# EAGLE design Carriage 0 (EAGLE 9.5.2)
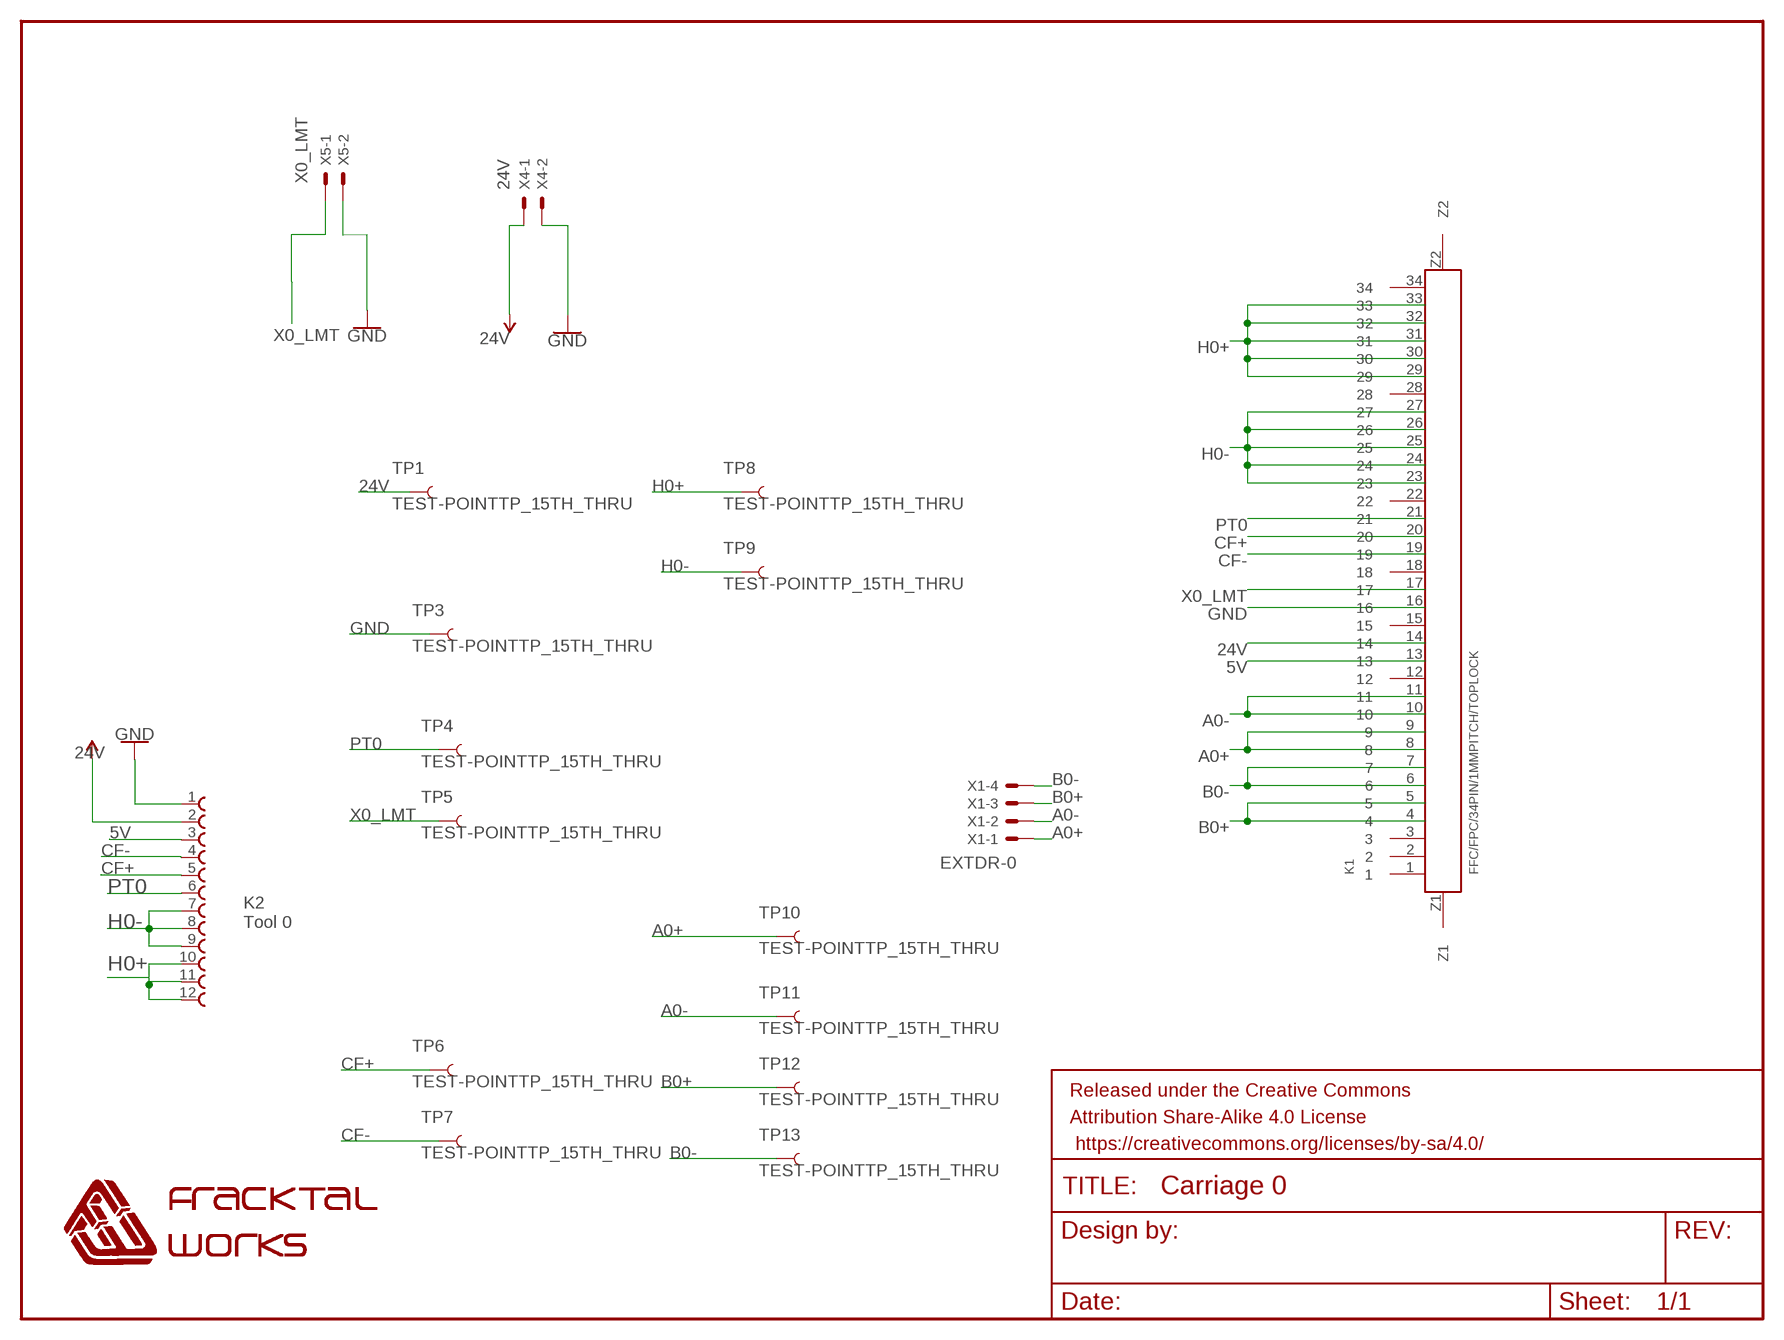
[diagram p0: schematic, sheet 1]

## Parts
FRAME1  FRAME-LETTER  [CREATIVE_COMMONS]
K1  FFC/FPC/34PIN/1MMPITCH/TOPLOCK  [34PIN/1MMPITCH/FFC/FPC]
K2  Tool 0  68611214122  [68611214122]
TP1  TEST-POINTTP_15TH_THRU  [TP_15TH]
TP3  TEST-POINTTP_15TH_THRU  [TP_15TH]
TP4  TEST-POINTTP_15TH_THRU  [TP_15TH]
TP5  TEST-POINTTP_15TH_THRU  [TP_15TH]
TP6  TEST-POINTTP_15TH_THRU  [TP_15TH]
TP7  TEST-POINTTP_15TH_THRU  [TP_15TH]
TP8  TEST-POINTTP_15TH_THRU  [TP_15TH]
TP9  TEST-POINTTP_15TH_THRU  [TP_15TH]
TP10  TEST-POINTTP_15TH_THRU  [TP_15TH]
TP11  TEST-POINTTP_15TH_THRU  [TP_15TH]
TP12  TEST-POINTTP_15TH_THRU  [TP_15TH]
TP13  TEST-POINTTP_15TH_THRU  [TP_15TH]
U$2  FWLOGO  [FWLOGO]
X1  EXTDR-0  JST-XH-04-PIN-LONG-PAD  [JST-XH-04-PACKAGE-LONG-PAD]
X4  24V  JST-XH-02-PIN-LONG-PAD  [JST-XH-02-PACKAGE-LONG-PAD]
X5  X_LMT  JST-XH-02-PIN-LONG-PAD  [JST-XH-02-PACKAGE-LONG-PAD]

## Nets
5V: K1.13 K2.3
24V: K1.14 K2.2 TP1.P$1 X4.1 ; supply symbol labelled 12V, VIN
A0+: K1.8 K1.9 TP10.P$1 X1.1
A0-: K1.10 K1.11 TP11.P$1 X1.2
B0+: K1.4 K1.5 TP12.P$1 X1.3
B0-: K1.6 K1.7 TP13.P$1 X1.4
CF+: K1.20 K2.5 TP6.P$1
CF-: K1.19 K2.4 TP7.P$1
GND: K1.16 K2.1 TP3.P$1 X4.2 X5.2
H0+: K1.29 K1.30 K1.31 K1.32 K1.33 K2.10 K2.11 K2.12 TP8.P$1
H0-: K1.23 K1.24 K1.25 K1.26 K1.27 K2.7 K2.8 K2.9 TP9.P$1
PT0: K1.21 K2.6 TP4.P$1
X0_LMT: K1.17 TP5.P$1 X5.1
Unconnected: K1.1 K1.2 K1.3 K1.12 K1.15 K1.18 K1.22 K1.28 K1.34 K1.Z1 K1.Z2

## Library data of the parts
FRAME1 = SparkFun-Aesthetics:FRAME-LETTER: Schematic Frame - Letter Standard 8.5x11 US Letter frame
K1 = FracktalWorks_Eagle_Library:FFC/FPC/34PIN/1MMPITCH/TOPLOCK
K2 = Wurth_Elektronik_Electromechanic_FPC_Connectors_&_Flat_Flexible_Cable_rev15b:68611214122: WR-FPC 1.00mm SMT ZIF Horizontal Top Contact, 12 Pins=>Code : Con_FPC_ZIF_1.00_68611214122 <http://katalog.we-online.de/media/images/eican/Con_FPC_ZIF_1.00_6861xx14122_pf2.jpg> Details see: http://katalog.we-online.de/en/em/686_1xx_141_22 Created 2014-07-09, Karrer Zheng 2014 (C) Würth Elektronik
TP1 TP3-TP13 = SparkFun-Connectors:TEST-POINT: SparkFun Test Points Bare copper test points for troubleshooting or In-Circuit-Testing. These are used by our Production team for verifying production board runs using pogo-pins on test beds. SparkFun Products: SparkFun LSM9DS1 Breakout <https://www.sparkfun.com/products/13284> SparkFun PSOC <https://www.sparkfun.com/products/13714> SparkFun Load Cell Amplifier <https://www.sparkfun.com/products/13879>
U$2 = FracktalWorks_Eagle_Library:FWLOGO
X1 = Rembrandt Electronics - JST XH Connectors v1-0:JST-XH-04-PIN: JST XH Connector 2 Pin Wire to board connector. Pitch: 2,54 mm, (0.100") Number of pins: 4 Created by Rembrandt Electronics www.rembrandtelectronics.com
X4 X5 = Rembrandt Electronics - JST XH Connectors v1-0:JST-XH-02-PIN: JST XH Connector 2 Pin Wire to board connector. Pitch: 2,54 mm, (0.100") Number of pins: 2 Created by Rembrandt Electronics www.rembrandtelectronics.com

## Board
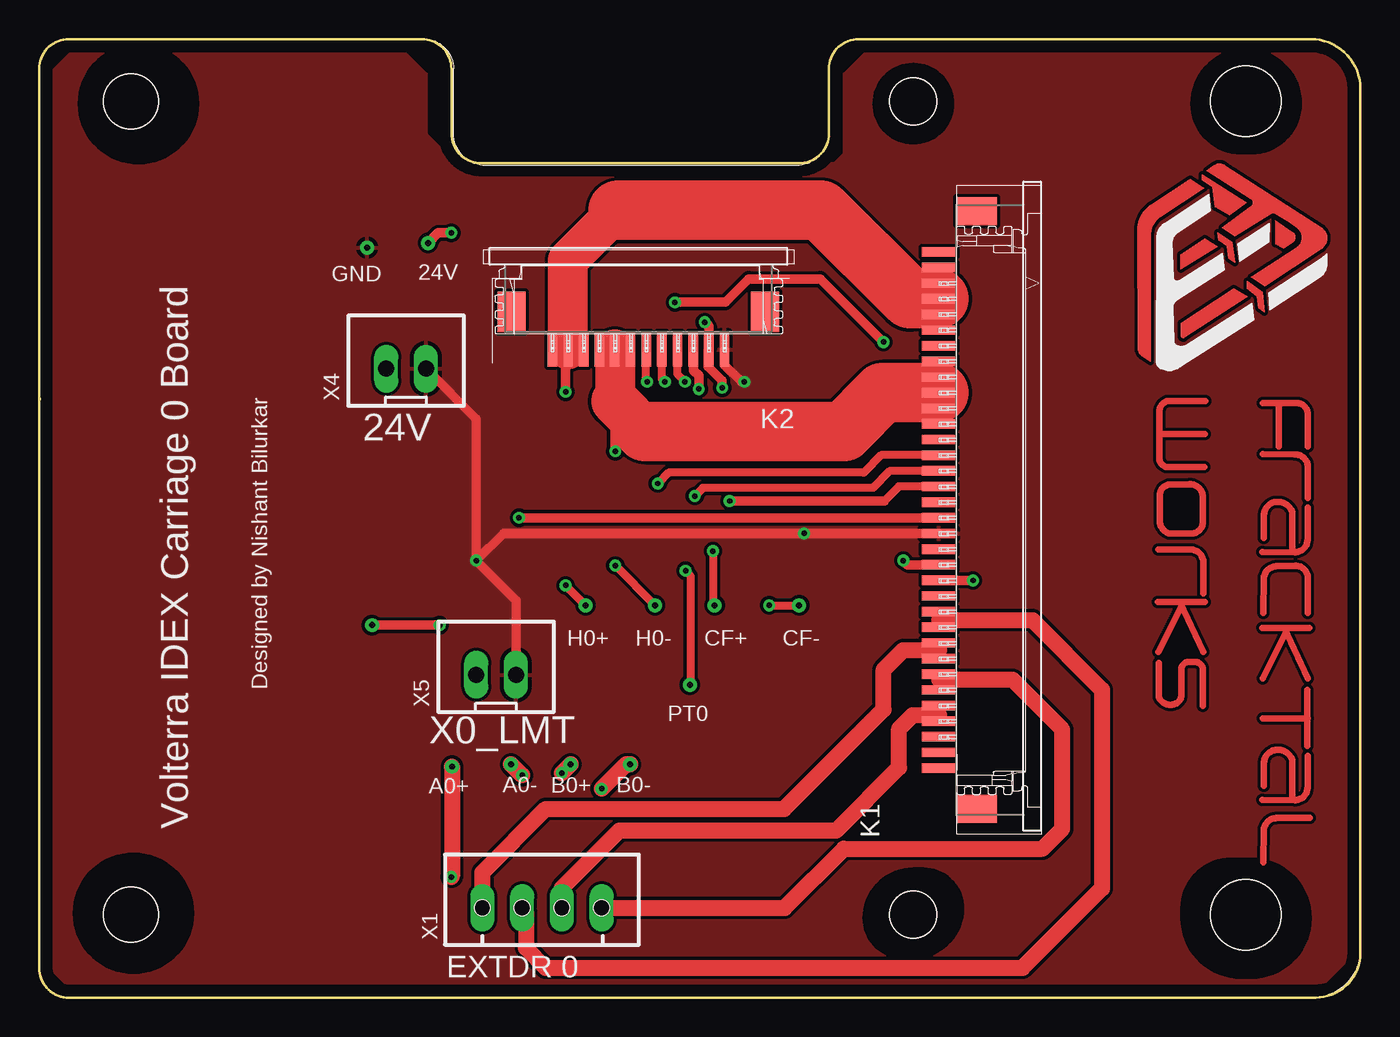
[diagram p1: board, top side]
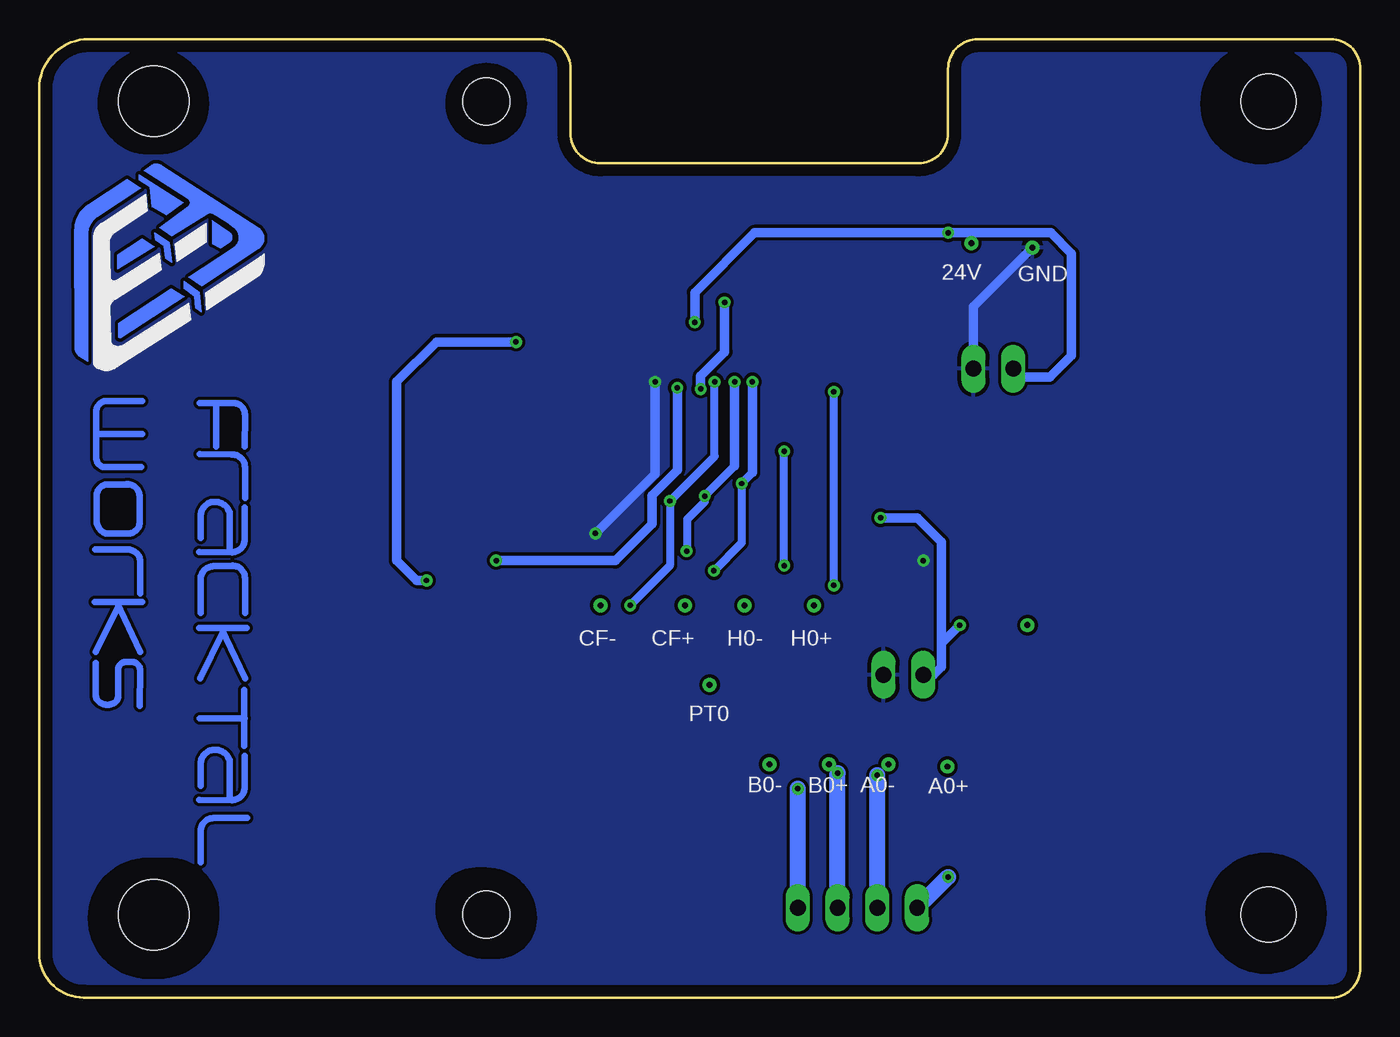
[diagram p2: board, bottom side, seen from below]

Size 84.45 x 61.28 mm. Coordinates in mm from the lower left corner, seen from the top.
Outline: 1.9,61.28 24.45,61.28 arc-90 26.35,59.37 26.35,55.24 arc90 28.26,53.34 48.58,53.34 arc90 50.48,55.24 50.48,59.37 arc-90 52.39,61.28 81.28,61.28 arc-90 84.45,58.1 84.45,2.86 arc-90 81.6,0 1.9,0 arc-90 0,1.9 0,59.37 arc-90 1.9,61.28
Copper layers (1*16): Top 0.035mm / dielectric 1.5mm / Bottom 0.035mm
Design rules "LionCircuits": minimum track width 8mil, minimum drill 0.35mm, track to track 8mil, track to pad 8mil, pad to pad 8mil, via to via 8mil, smd to smd 8mil, copper to edge 30mil, drill to drill 10mil, minimum pad ring 10mil, minimum via ring 8mil, stop-mask expansion 4mil, vias tented up to drill 0mil, thermal gap 10mil
Holes 4.5 mm at 77.12,57.31 77.12,5.31
Holes 3 mm at 55.88,5.3 55.88,57.31
Holes 3.51 mm at 5.88,57.31 5.88,5.3

### Footprints (pad centres in the part's own frame; a part is rotated, then mirrored left to right if it is on the bottom)
34PIN/1MMPITCH/FFC/FPC = smd 0.6 x 2.2: 1 -14.43,2.1; 2 -13.43,2.1; 3 -12.43,2.1; 4 -11.43,2.1; 5 -10.43,2.1; 6 -9.43,2.1; 7 -8.43,2.1; 8 -7.43,2.1; 9 -6.43,2.1; 10 -5.43,2.1; 11 -4.43,2.1; 12 -3.43,2.1; 13 -2.43,2.1; 14 -1.43,2.1; 15 -0.43,2.1; 16 0.57,2.1; 17 1.57,2.1; 18 2.57,2.1; 19 3.57,2.1; 20 4.57,2.1; 21 5.57,2.1; 22 6.57,2.1; 23 7.57,2.1; 24 8.57,2.1; 25 9.57,2.1; 26 10.57,2.1; 27 11.57,2.1; 28 12.57,2.1; 29 13.57,2.1; 30 14.57,2.1; 31 15.57,2.1; 32 16.57,2.1; 33 17.57,2.1; 34 18.57,2.1 | smd 1.8 x 2.6: Z1 -17.03,-0.3; Z2 21.17,-0.3
68611214122 = smd 0.6 x 2.2: 1 -8.5,1.1; 2 -7.5,1.1; 3 -6.5,1.1; 4 -5.5,1.1; 5 -4.5,1.1; 6 -3.5,1.1; 7 -2.5,1.1; 8 -1.5,1.1; 9 -0.5,1.1; 10 0.5,1.1; 11 1.5,1.1; 12 2.5,1.1 | smd 1.8 x 2.6: Z1 -11.1,-1.3; Z2 5.1,-1.3
TP_15TH = drill 0.381 pad 0.61: P$1 0,0
JST-XH-04-PACKAGE-LONG-PAD = drill 1.016 long: 1 -3.81,0; 2 -1.27,0; 3 1.27,0; 4 3.81,0
JST-XH-02-PACKAGE-LONG-PAD = drill 1.016 long: 1 -1.27,0; 2 1.27,0

### Placement (x,y rotation side)
FRAME1  -90.81,8.26 0 top  (outside the outline)
K1  59.63,29.11 90 top
K2  35.31,42.54 180 top
TP1  24.87,48.25 0 bottom
TP3  20.95,47.94 0 bottom
TP4  41.59,20 0 bottom
TP5  21.27,23.81 0 bottom
TP6  43.18,25.08 0 bottom
TP7  48.58,25.08 0 bottom
TP8  34.92,25.08 0 bottom
TP9  39.37,25.08 0 bottom
TP10  26.39,14.77 0 bottom
TP11  30.16,14.92 0 bottom
TP12  33.97,14.92 0 bottom
TP13  37.78,14.92 0 bottom
U$1  FWLOGO  [FWLOGO]  85.72,53.97 270 bottom
U$2  66.67,53.97 270 top
X1  32.14,5.74 0 top
X4  23.46,40.21 0 top
X5  29.21,20.64 0 top

### Tracks (layer width: path | path; a pad name or v marks a point on that pad's centre or on a via)
5V  (via drill 0.35)
  Top 0.61: K2.3 41.81,40.1 42.16,39.75 v42.16,38.91 | v40.64,44.45 43.86,44.45 45.35,45.95 49.94,45.95 v53.97,41.91 | v59.69,26.67 K1.13
  Bottom 0.61: v42.16,38.91 42.16,39.75 40.64,41.27 v40.64,44.45 | v53.97,41.91 59.05,41.91 61.59,39.37 61.59,27.94 60.33,26.67 v59.69,26.67
24V  (via drill 0.35)
  Top 0.61: v26.35,48.89 25.51,48.89 TP1.P$1 | v42.55,43.18 42.81,42.92 K2.2 42.77,41.41 42.77,40.34 43.66,39.45 v43.66,38.99 | v55.25,27.94 55.51,27.68 K1.14
  Bottom 0.61: v42.55,43.18 42.55,45.09 38.73,48.89 v26.35,48.89 19.8,48.89 18.47,47.56 18.47,41.05 19.84,39.67 21.65,39.67 X4.1 | v43.66,38.99 43.66,33.72 45.28,32.1 45.28,30.28 47.62,27.94 v55.25,27.94
A0+  (via drill 0.35)
  Top 0.61: K1.9 57.53,22.23 K1.8
  Top 1.016: X1.1 28.33,8.01 32.38,12.06 47.62,12.06 53.97,18.41 53.97,20.95 55.25,22.23 57.53,22.23 | TP10.P$1 26.39,7.76 v26.35,7.72
  Bottom 1.016: X1.1 v26.35,7.72
A0-  (via drill 0.35)
  Top 0.61: K1.11 57.53,24.13 K1.10
  Top 1.016: X1.2 31.11,5.5 31.11,3.17 32.38,1.9 62.86,1.9 67.94,6.98 67.94,19.69 63.5,24.13 57.53,24.13 | v30.87,14.21 TP11.P$1
  Bottom 1.016: X1.2 v30.87,14.21
B0+  (via drill 0.35)
  Top 0.61: K1.4 57.53,18.07 K1.5
  Top 1.016: X1.3 33.41,7.01 37.09,10.69 50.95,10.69 54.97,14.71 54.97,17.2 55.84,18.07 57.53,18.07 | v33.41,14.36 TP12.P$1
  Bottom 1.016: X1.3 v33.41,14.36
B0-  (via drill 0.35)
  Top 0.61: K1.7 57.53,20.32 K1.6
  Top 1.016: X1.4 47.65,5.74 51.43,9.53 64.14,9.53 65.41,10.79 65.41,17.14 62.23,20.32 57.53,20.32 | v35.95,13.36 37.52,14.92 TP13.P$1
  Bottom 1.016: X1.4 v35.95,13.36
CF+  (via drill 0.35)
  Top 0.508: K1.20 57.51,33.65 54.37,33.65 53.3,32.59 42.43,32.59 v41.91,32.07 | v43.07,28.55 43.07,25.2 TP6.P$1 | v40,39.37 39.81,39.57 K2.5
  Bottom 0.508: v43.07,28.55 43.07,28.78 43.03,28.82 43.03,30.57 41.91,31.69 v41.91,32.07 40,33.97
  Bottom 0.61: 40,33.97 v40,39.37
CF-  (via drill 0.35)
  Top 0.508: K1.19 54.96,32.68 54.03,31.75 | v46.67,25.08 TP7.P$1 | v41.27,39.37 40.81,39.84 K2.4
  Top 0.61: 54.03,31.75 v44.13,31.75
  Bottom 0.508: v46.67,25.08 44.13,27.62 v44.13,31.75 41.27,34.61 v41.27,39.37
GND  (via drill 0.35)
  Top 0.61: K1.16 v48.89,29.68 29.68,29.68 v27.94,27.94 | v45.09,39.37 44.89,39.37 43.81,40.45 K2.1 | X4.2 27.94,36.99 v27.94,27.94 | v27.94,27.94 30.48,25.4 X5.2
  Bottom 0.61: v45.09,39.37 45.09,33.49 v48.89,29.68 | TP3.P$1 24.73,44.17 X4.2
  pour Top: 50.8,53.34 26.67,53.34 24.77,55.24 24.77,59.05 22.23,61.59 3.18,61.59 0.63,59.05 0.63,1.9 3.18,-0.64 80.64,-0.64 83.82,2.54 83.82,59.05 81.91,60.96 53.34,60.96 51.43,59.05 51.43,53.97
  pour Bottom: 36.2,53.97 27.3,53.97 26.03,55.24 26.03,60.32 24.77,61.59 1.9,61.59 -0.63,59.05 -0.63,1.9 3.18,-1.91 80.64,-1.91 84.45,1.9 84.45,59.05 81.91,61.59 51.43,61.59 50.16,60.32 50.16,53.97
  cutout Top: 6.35,60.96 arc90 2.54,57.15 arc90 6.35,53.34 arc90 10.16,57.15 arc90
  cutout Top: 6.03,9.21 arc90 2.22,5.4 arc90 6.03,1.59 arc90 9.84,5.4 arc90
  cutout Top: 56.52,8.26 55.88,8.26 arc90 52.7,5.08 arc90 55.25,2.54 55.88,2.54 arc90 59.05,5.71 arc90
  cutout Top: 76.83,8.89 76.2,8.89 arc90 73.02,5.71 73.02,5.08 arc90 76.83,1.27 77.47,1.27 arc90 81.28,5.08 arc90 77.47,8.89
  cutout Top: 77.15,60.64 arc90 73.66,57.15 arc90 76.83,53.97 77.47,53.97 arc90 80.64,57.15 arc90
  cutout Top: 55.88,59.69 arc90 53.34,57.15 arc90 55.88,54.61 arc90 58.42,57.15 arc90
  cutout Bottom: 6.35,60.96 arc90 2.54,57.15 arc90 6.35,53.34 arc90 10.16,57.15 arc90
  cutout Bottom: 6.03,9.21 arc90 2.22,5.4 arc90 6.03,1.59 arc90 9.84,5.4 arc90
  cutout Bottom: 56.52,8.26 55.88,8.26 arc90 52.7,5.08 arc90 55.25,2.54 55.88,2.54 arc90 59.05,5.71 arc90
  cutout Bottom: 76.83,8.89 76.2,8.89 arc90 73.02,5.71 73.02,5.08 arc90 76.83,1.27 77.47,1.27 arc90 81.28,5.08 arc90 77.47,8.89
  cutout Bottom: 77.15,60.64 arc90 73.66,57.15 arc90 76.83,53.97 77.47,53.97 arc90 80.64,57.15 arc90
  cutout Bottom: 55.88,59.69 arc90 53.34,57.15 arc90 55.88,54.61 arc90 58.42,57.15 arc90
H0+  (via drill 0.35)
  Top 0.508: TP8.P$1 v33.66,26.35 | 33.66,41.29 K2.11
  Top 0.61: K1.33 K1.32 K1.31 K1.30 K1.29 | v33.66,38.73 33.66,41.29 33.5,41.45 K2.12 | K2.11 K2.10
  Top 2.54: K2.11 33.81,47.14 37.01,50.34
  Top 3.81: K1.31 55.65,44.68 49.99,50.34 37.01,50.34
  Bottom 0.508: v33.66,26.35 v33.66,38.73
H0-  (via drill 0.35)
  Top 0.508: TP9.P$1 v36.83,27.62 | v36.83,34.92 36.81,34.95
  Top 0.61: K1.27 K1.26 K1.25 K1.24 K1.23 | 36.81,34.95 36.81,38.12 | K2.9 K2.8 K2.7
  Top 2.54: K2.8 36.81,38.12
  Top 3.048: 36.81,38.12 38.73,36.2
  Top 3.81: K1.25 53.92,38.68 51.43,36.2 38.73,36.2
  Bottom 0.508: v36.83,27.62 v36.83,34.92
PT0  (via drill 0.35)
  Top 0.508: K1.21 53.82,34.68 52.71,33.57 40.25,33.57 v39.55,32.87 | v41.33,27.29 41.63,26.99 41.63,20.04 TP4.P$1 | v38.86,39.37 38.81,39.42 K2.6
  Bottom 0.508: v41.33,27.29 39.55,29.07 v39.55,32.87 38.86,33.55
  Bottom 0.61: 38.86,33.55 v38.86,39.37
X0_LMT  (via drill 0.35)
  Top 0.61: K1.17 v30.68,30.68 | TP5.P$1 v25.6,23.81
  Bottom 0.61: v30.68,30.68 28.33,30.68 26.77,29.12 26.77,22.64 | 26.77,22.64 26.77,21.16 27.29,20.64 X5.1 | v25.6,23.81 26.77,22.64

### Text on the board
tPlace: GND | 24V | 24V | H0+ | H0- | CF+ | CF- | Designed by Nishant Bilurkar | PT0 | X0_LMT | A0+ | A0- | B0+ | B0- | Volterra IDEX Carriage 0 Board | EXTDR 0
bPlace: GND | 24V | H0+ | H0- | CF+ | CF- | PT0 | A0+ | A0- | B0+ | B0-